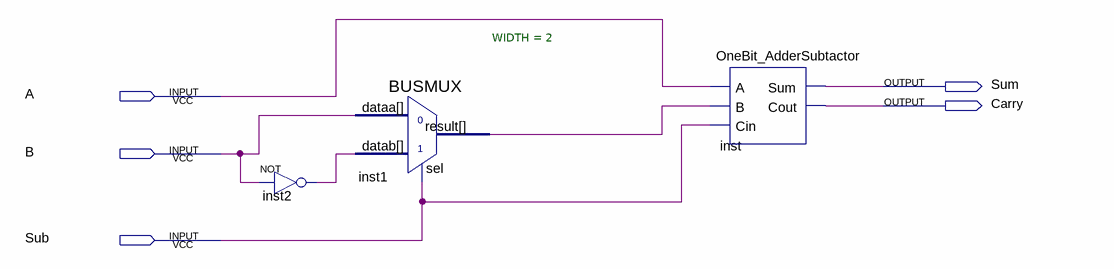
[diagram p0: schematic sheet]
// Quartus schematic AddSub_1Bit.bdf as structural Verilog: 3 symbols, 5 pins
module AddSub_1Bit (
  input  A,
  input  B,
  input  Sub,
  output Sum,
  output Carry
);

  wire inst1_result, inst2_out;

  not inst2 (inst2_out, B);
  BUSMUX #(.WIDTH(2)) inst1 (.datab({2{inst2_out}}), .sel(Sub), .dataa({2{B}}), .result(inst1_result));
  OneBit_AdderSubtactor inst (.A(A), .B(inst1_result), .Cin(Sub), .Sum(Sum), .Cout(Carry));
endmodule
